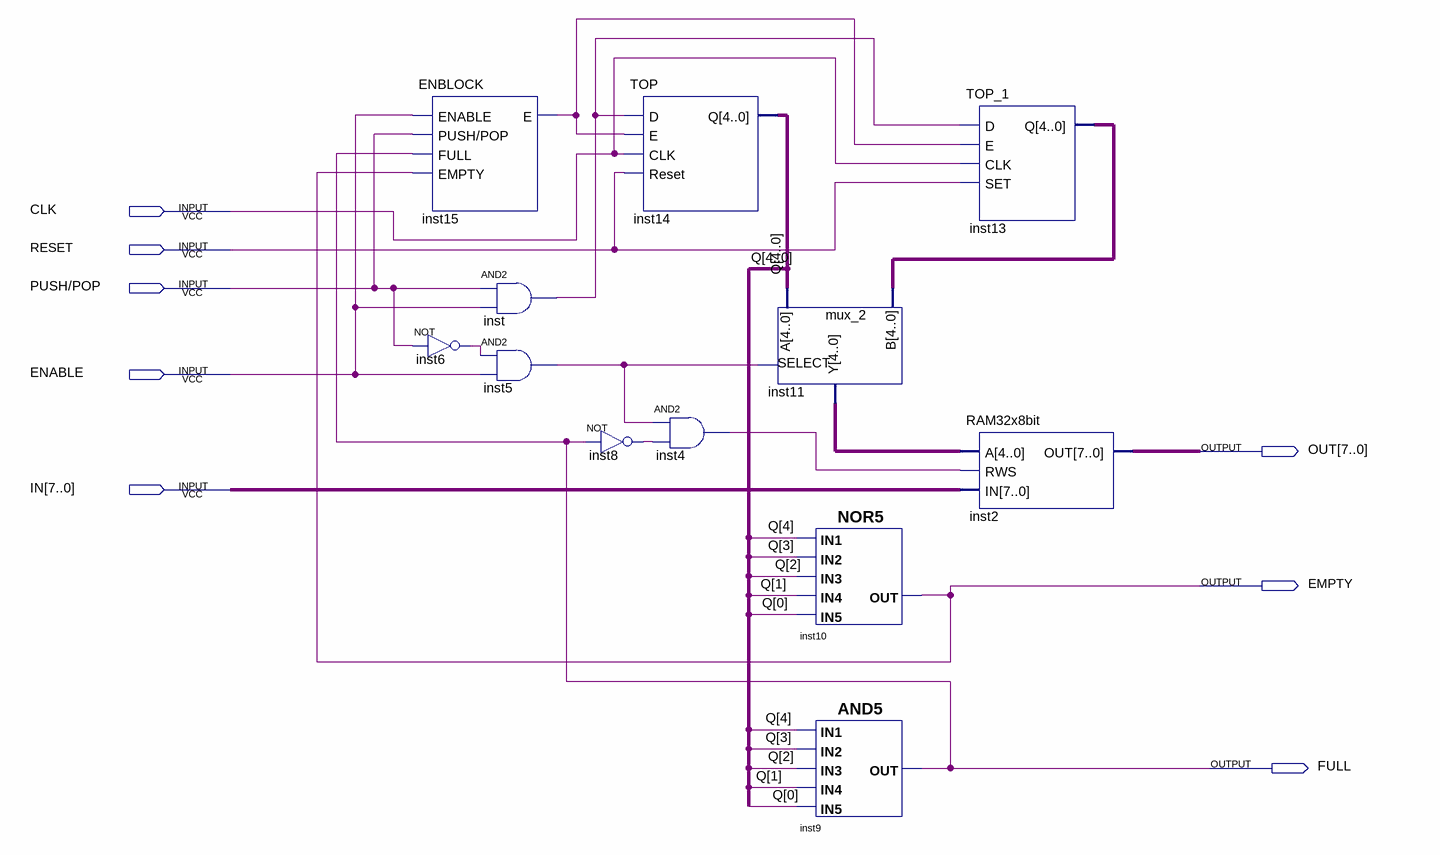
[diagram p0: schematic sheet]
// Quartus schematic STACK32X8BIT.bdf as structural Verilog: 12 symbols, 8 pins
module STACK32X8BIT (
  input  CLK,
  input  RESET,
  input  \PUSH/POP ,
  input  ENABLE,
  input  [7:0] IN,
  output [7:0] OUT,
  output EMPTY,
  output FULL
);

  wire inst4_out, inst5_out, inst6_out, inst8_out, inst15_e, inst_out;
  wire [4:0] inst11_y, inst13_q, Q;

  ENBLOCK inst15 (.ENABLE(ENABLE), .\PUSH/POP (\PUSH/POP ), .FULL(FULL), .EMPTY(EMPTY), .E(inst15_e));
  not inst6 (inst6_out, \PUSH/POP );
  and inst (inst_out, \PUSH/POP , ENABLE);
  and inst5 (inst5_out, inst6_out, ENABLE);
  not inst8 (inst8_out, FULL);
  TOP inst14 (.D(inst_out), .E(inst15_e), .CLK(CLK), .Reset(RESET), .Q(Q));
  and inst4 (inst4_out, inst5_out, inst8_out);
  mux_2 inst11 (.SELECT(inst5_out), .A(Q), .B(inst13_q), .Y(inst11_y));
  nor inst10 (EMPTY, Q[4], Q[3], Q[2], Q[1], Q[0]);
  and inst9 (FULL, Q[4], Q[3], Q[2], Q[1], Q[0]);
  TOP_1 inst13 (.D(inst_out), .E(inst15_e), .CLK(CLK), .SET(RESET), .Q(inst13_q));
  RAM32x8bit inst2 (.A(inst11_y), .RWS(inst4_out), .IN(IN), .OUT(OUT));
endmodule
